# EAGLE design hk310_esc (EAGLE 9.6.1)
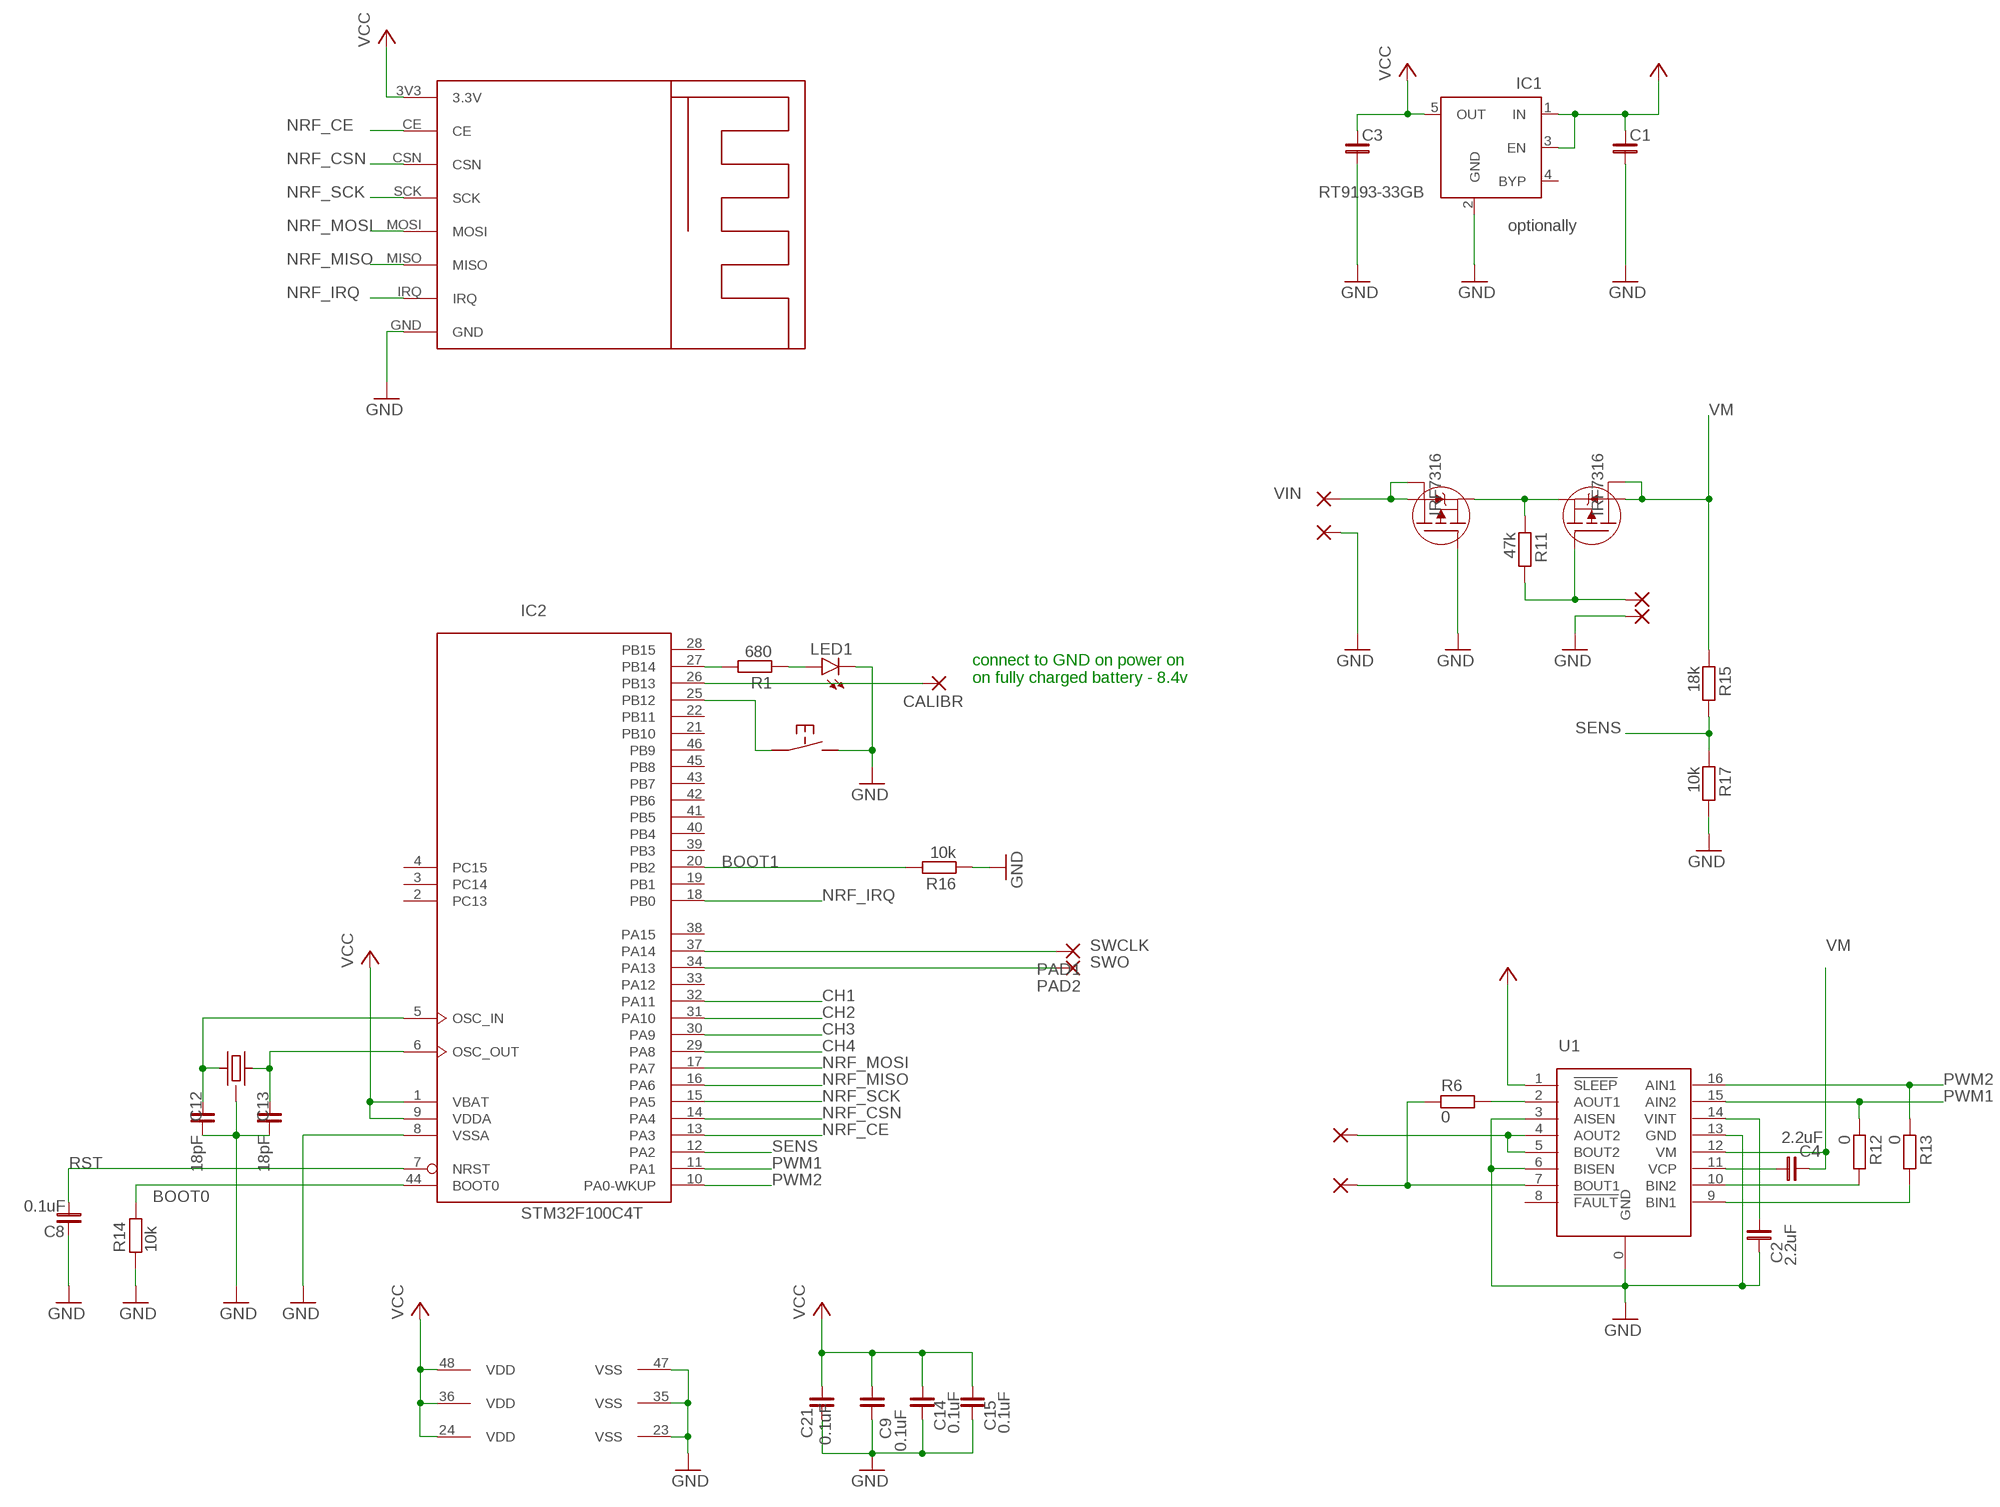
[diagram p0: schematic, sheet 1, part 1 of 2]
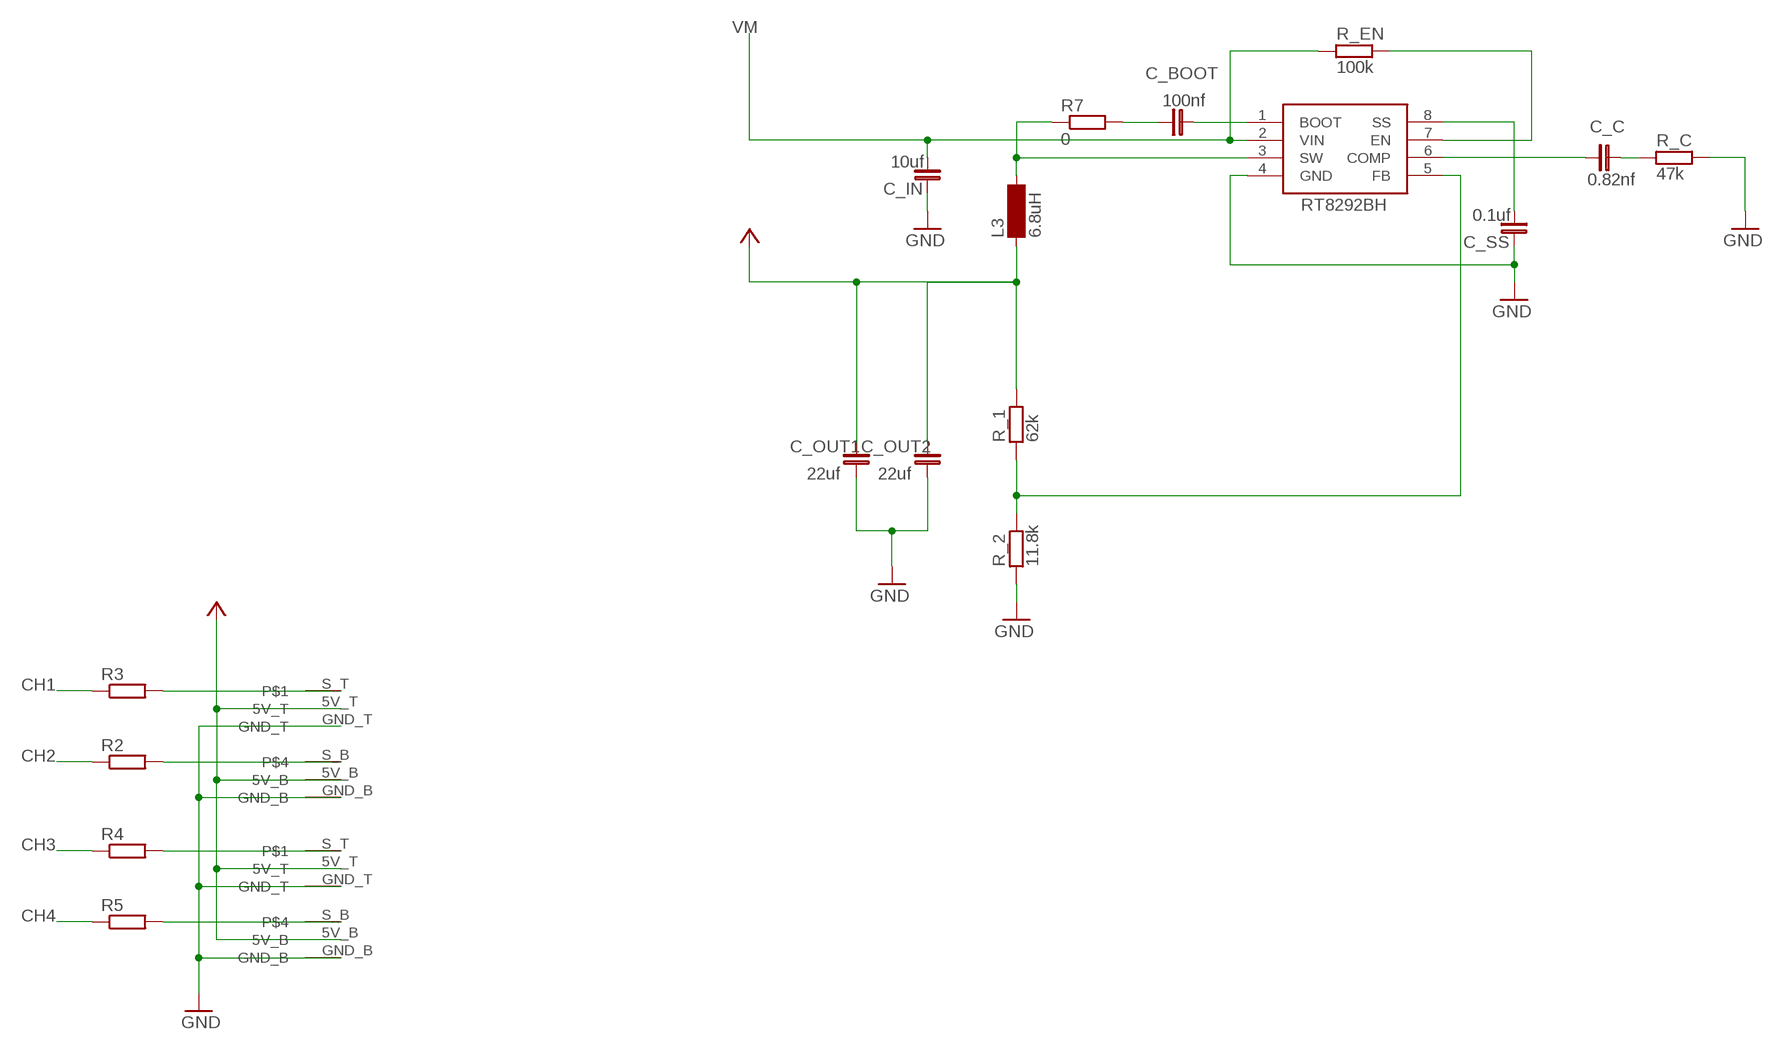
[diagram p1: schematic, sheet 1, part 2 of 2]

## Parts
C1  C_0805  [C0805]
C2  2.2uF  C_0805  [C0805]
C3  C_0805  [C0805]
C4  2.2uF  C_0805  [C0805]
C8  0.1uF  C_0603  [C0603]
C9  0.1uF  C_0603  [C0603]
C12  18pF  C_0603  [C0603]
C13  18pF  C_0603  [C0603]
C14  0.1uF  C_0603  [C0603]
C15  0.1uF  C_0603  [C0603]
C21  0.1uF  C_0603  [C0603]
C_BOOT  100nf  C_0402  [C0402]
C_C  0.82nf  C_0402  [C0402]
C_IN  10uf  C_1206  [C1206]
C_OUT1  22uf  C_0805  [C0805]
C_OUT2  22uf  C_0805  [C0805]
C_SS  0.1uf  C_0402  [C0402]
CALIBR  SMD2  [SMD1,27-2,54]
IC1  RT9193-33GB  MIC5219XX  [SOT23-5]
IC2  STM32F100C4T  [LQFP48]
L3  6.8uH  MS85  [MS85]
LED1  LED  [SMARTLED-TTW]
PAD1  SMD2  [SMD1,27-2,54]
PAD2  SMD2  [SMD1,27-2,54]
PAD3  WIREPADSMD5-1,8  [5-1,8]
PAD4  WIREPADSMD5-1,8  [5-1,8]
PAD5  WIREPADSMD5-1,8  [5-1,8]
PAD6  WIREPADSMD5-1,8  [5-1,8]
PAD7  WIREPADSMD5-1,8  [5-1,8]
PAD8  WIREPADSMD5-1,8  [5-1,8]
R1  680  R_0805  [R0805]
R2  R-EU_R1206  [R1206]
R3  R-EU_R1206  [R1206]
R4  R-EU_R1206  [R1206]
R5  R-EU_R1206  [R1206]
R6  0  R_1206  [R1206]
R7  0  R-EU_R1206  [R1206]
R11  47k  R_0805  [R0805]
R12  0  R_1206  [R1206]
R13  0  R_1206  [R1206]
R14  10k  R_0805  [R0805]
R15  18k  R_0805  [R0805]
R16  10k  R_0805  [R0805]
R17  10k  R_0805  [R0805]
R_1  62k  R_0402  [R0402]
R_2  11.8k  R_0402  [R0402]
R_C  47k  R_0402  [R0402]
R_EN  100k  R_0402  [R0402]
RT8292BH  RT8292B  [SO8-2]
U1  DRV8833  [PWP16]
U$1  NRF24MINI  [NRF24MINI]
U$2  PINHEAD_SMD  [PINHEAD_SMD]
U$3  PINHEAD_SMD  [PINHEAD_SMD]
U$5  IRF7104  [SO8-2]
U$6  8Mhz  CRYSTAL_3PINS  [CRYSTAL_3PINS]
U$7  SMALL_BUTTON  [SMALL_BUTTON]

## Nets
+5V: C1.1 C_OUT1.2 C_OUT2.2 IC1.1(IN) IC1.3(EN) L3.1 R_1.2 U1.1(!SLEEP) U$2.5V_B U$2.5V_T U$3.5V_B U$3.5V_T
BOOT0: IC2.44(BOOT0) R14.2
BOOT1: IC2.20(PB2) R16.2
CH1: IC2.32(PA11) R3.1
CH2: IC2.31(PA10) R2.1
CH3: IC2.30(PA9) R4.1
CH4: IC2.29(PA8) R5.1
GND: C1.2 C2.1 C3.2 C8.1 C9.1 C12.1 C13.1 C14.1 C15.1 C21.1 C_IN.1 C_OUT1.1 C_OUT2.1 C_SS.1 IC1.2(GND) IC2.8(VSSA) IC2.23(VSS) IC2.35(VSS) IC2.47(VSS) LED1.C@1(C) PAD5.1(P) PAD8.1(P) R14.1 R16.1 R17.2 R_2.1 R_C.2 RT8292BH.4(GND) U1.0(GND) U1.3(AISEN) U1.6(BISEN) U1.13(GND) U$1.GND U$2.GND_B U$2.GND_T U$3.GND_B U$3.GND_T U$5.4(G) U$6.GND U$7.2_1 U$7.2_2
N$1: IC2.25(PB12) U$7.1_1 U$7.1_2
N$3: IC2.27(PB14) R1.2
N$5: LED1.A@1(A) R1.1
N$6: PAD3.1(P) U1.4(AOUT2) U1.5(BOUT2)
N$9: R6.2 U1.2(AOUT1)
N$10: C2.2 U1.14(VINT)
N$11: C4.2 U1.11(VCP)
N$12: CALIBR.1(P) IC2.26(PB13)
N$14: C12.2 IC2.5(OSC_IN) U$6.P$1
N$15: R12.2 U1.10(BIN2)
N$17: R3.2 U$2.S_T
N$18: R2.2 U$2.S_B
N$19: R4.2 U$3.S_T
N$20: R5.2 U$3.S_B
N$21: PAD7.1(P) R6.1 U1.7(BOUT1)
N$22: C_BOOT.1 R7.2
N$27: C13.2 IC2.6(OSC_OUT) U$6.P$2
N$28: PAD6.1(P) R11.2 U$5.2(G)
N$29: R13.2 U1.9(BIN1)
N$30: R_EN.2 RT8292BH.7(EN)
N$33: C_SS.2 RT8292BH.8(SS)
N$34: C_BOOT.2 RT8292BH.1(BOOT)
N$35: L3.2 R7.1 RT8292BH.3(SW)
N$36: R_1.1 R_2.2 RT8292BH.5(FB)
N$38: C_C.2 R_C.1
N$39: C_C.1 RT8292BH.6(COMP)
NRF_CE: IC2.13(PA3) U$1.CE
NRF_CSN: IC2.14(PA4) U$1.CSN
NRF_IRQ: IC2.18(PB0) U$1.IRQ
NRF_MISO: IC2.16(PA6) U$1.MISO
NRF_MOSI: IC2.17(PA7) U$1.MOSI
NRF_SCK: IC2.15(PA5) U$1.SCK
PWM1: IC2.11(PA1) R12.1 U1.15(AIN2)
PWM2: IC2.10(PA0-WKUP) R13.1 U1.16(AIN1)
RST: C8.2 IC2.7(NRST)
SENS: IC2.12(PA2) R15.2 R17.1
SWCLK: IC2.37(PA14) PAD1.1(P)
SWO: IC2.34(PA13) PAD2.1(P)
VCC: C3.1 C9.2 C14.2 C15.2 C21.2 IC1.5(OUT) IC2.1(VBAT) IC2.9(VDDA) IC2.24(VDD) IC2.36(VDD) IC2.48(VDD) U$1.3V3(3.3V)
VIN: PAD4.1(P) U$5.5(D) U$5.6(D)
VIN_PROT: R11.1 U$5.1(S) U$5.3(S)
VM: C4.1 C_IN.2 R15.1 R_EN.1 RT8292BH.2(VIN) U1.12(VM) U$5.7(D) U$5.8(D)
Unconnected: IC1.4(BYP) IC2.2(PC13) IC2.3(PC14) IC2.4(PC15) IC2.19(PB1) IC2.21(PB10) IC2.22(PB11) IC2.28(PB15) IC2.33(PA12) IC2.38(PA15) IC2.39(PB3) IC2.40(PB4) IC2.41(PB5) IC2.42(PB6) IC2.43(PB7) IC2.45(PB8) IC2.46(PB9) U1.8(!FAULT)

## Notes on the sheet
- optionally
- connect to GND on power on
  on fully charged battery - 8.4v

## Library data of the parts
C1-C4 C8 C9 C12-C15 C21 C_BOOT C_C C_IN C_OUT1 C_OUT2 C_SS = skydrop:C_: NON-POLARIZED CAP
CALIBR PAD1 PAD2 = wirepad:SMD2: SMD PAD
IC1 = skydrop:MIC5219XX: VOLTAGE REGULATOR; OC_FARNELL: unknown; OC_NEWARK: unknown
IC2 = micro-stm_v3:STM32F100C*T: ARM 32-bit Cortex™-M3 CPU 24 MHz maximum frequency 16 to 128 Kbytes of Flash memory 4 to 8 kbytes of SRAM 37 GPIOs 2.0 to 3.6 V application supply
L3 = inductor-neosid:MS85: INDUCTOR SMD power inductor; OC_FARNELL: unknown; OC_NEWARK: unknown
LED1 = led:LED: LED OSRAM: - CHIPLED LG R971, LG N971, LY N971, LG Q971, LY Q971, LO R971, LY R971 LH N974, LH R974 LS Q976, LO Q976, LY Q976 LO Q996 - Hyper CHIPLED LW Q18S LB Q993, LB Q99A, LB R99A - SideLED LS A670, LO A670, LY A670, LG A670, LP A670 LB A673, LV A673, LT A673, LW A673 LH A674 LY A675 LS A676, LA A676, LO A676, LY A676, LW A676 LS A679, LY A679, LG A679 - Hyper Micro SIDELED® LS Y876, LA Y876, LO Y876, LY Y876 LT Y87S - SmartLED LW L88C, LW L88S LB L89C, LB L89S, LG L890 LS L89K, LO L89K, LY L89K LS L896, LA L896, LO L896, LY L896 - TOPLED LS T670, LO T670, LY T670, LG T670, LP T670 LSG T670, LSP T670, LSY T670, LOP T670, LYG T670 LG T671, LOG T671, LSG T671 LB T673, LV T673, LT T673, LW T673 LH T674 LS T676, LA T676, LO T676, LY T676, LB T676, LH T676, LSB T676, LW T676 LB T67C, LV T67C, LT T67C, LS T67K, LO T67K, LY T67K, LW E67C LS E67B, LA E67B, LO E67B, LY E67B, LB E67C, LV E67C, LT E67C LW T67C LS T679, LY T679, LG T679 LS T770, LO T770, LY T770, LG T770, LP T770 LB T773, LV T773, LT T773, LW T773 LH T774 LS E675, LA E675, LY E675, LS T675 LS T776, LA T776, LO T776, LY T776, LB T776 LHGB T686 LT T68C, LB T68C - Hyper Mini TOPLED® LB M676 - Mini TOPLED Santana® LG M470 LS M47K, LO M47K, LY M47K Source: http://www.osram.convergy.de LUXEON: - LUMILED® LXK2-PW12-R00, LXK2-PW12-S00, LXK2-PW14-U00, LXK2-PW14-V00 LXK2-PM12-R00, LXK2-PM12-S00, LXK2-PM14-U00 LXK2-PE12-Q00, LXK2-PE12-R00, LXK2-PE12-S00, LXK2-PE14-T00, LXK2-PE14-U00 LXK2-PB12-K00, LXK2-PB12-L00, LXK2-PB12-M00, LXK2-PB14-N00, LXK2-PB14-P00, LXK2-PB14-Q00 LXK2-PR12-L00, LXK2-PR12-M00, LXK2-PR14-Q00, LXK2-PR14-R00 LXK2-PD12-Q00, LXK2-PD12-R00, LXK2-PD12-S00 LXK2-PH12-R00, LXK2-PH12-S00 LXK2-PL12-P00, LXK2-PL12-Q00, LXK2-PL12-R00 Source: www.luxeon.com KINGBRIGHT: KA-3528ASYC Source: www.kingbright.com
PAD3-PAD8 = wirepad:WIREPAD: Wire PAD connect wire on PCB
R1 R6 R11-R17 R_1 R_2 R_C R_EN = skydrop:R_: RESISTOR
R2-R5 R7 = skydrop:R-EU_: RESISTOR, European symbol
RT8292BH = skydrop:RT8292B; RT8292BH: RT8292BH
U1 = skydrop:DRV8833
U$1 = nrf24mini:NRF24MINI
U$2 U$3 = skydrop:PINHEAD_SMD
U$5 = irf-2:IRF7104: HEXFET® Power MOSFET Adavanced Process Technology Ultra Low On-Resistance Dual P-Channel MOSFET Surface Mount Available in Tape & Reel Dynamic dv/dt Rating Fast Switching Please connect both Drain-Pins of each FET for thermal Reasons! (Pin 5 with Pin 6, 7 with 8); IRF7316: IRF7316
U$6 = skydrop:CRYSTAL_3PINS
U$7 = skydrop:SMALL_BUTTON

## Net classes
1 vcc: width 0.3 mm

## Board
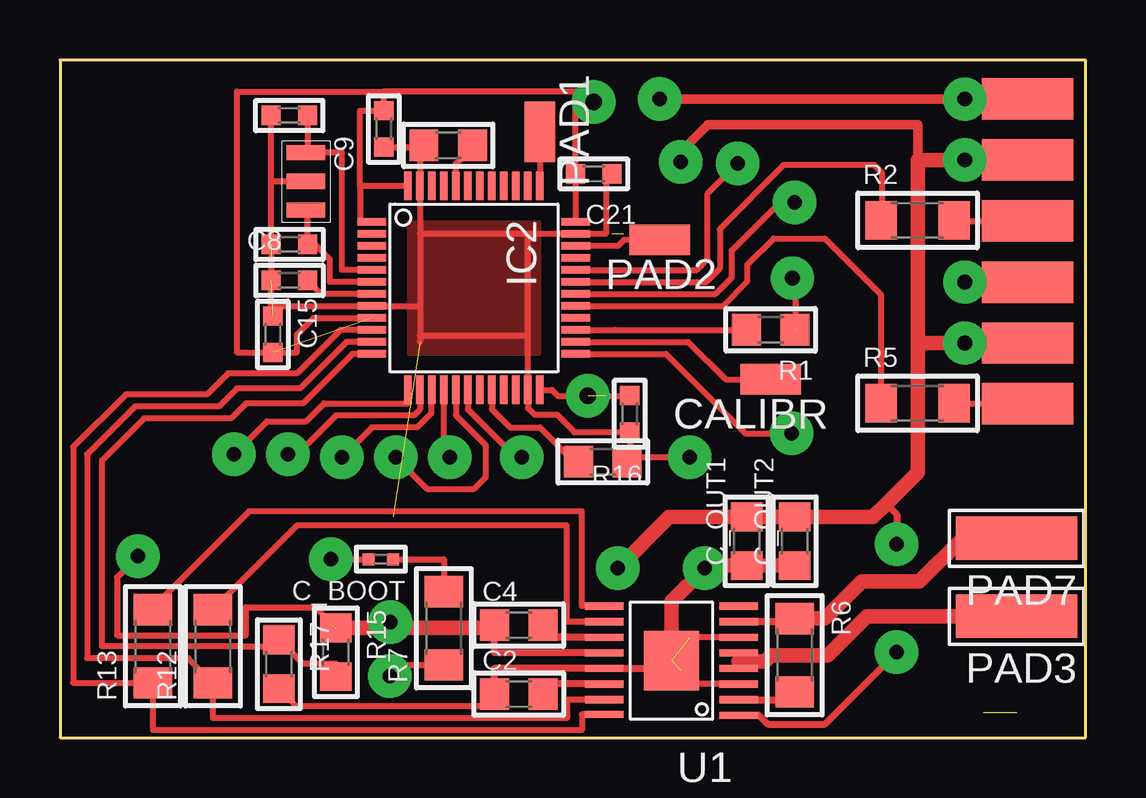
[diagram p2: board, top side]
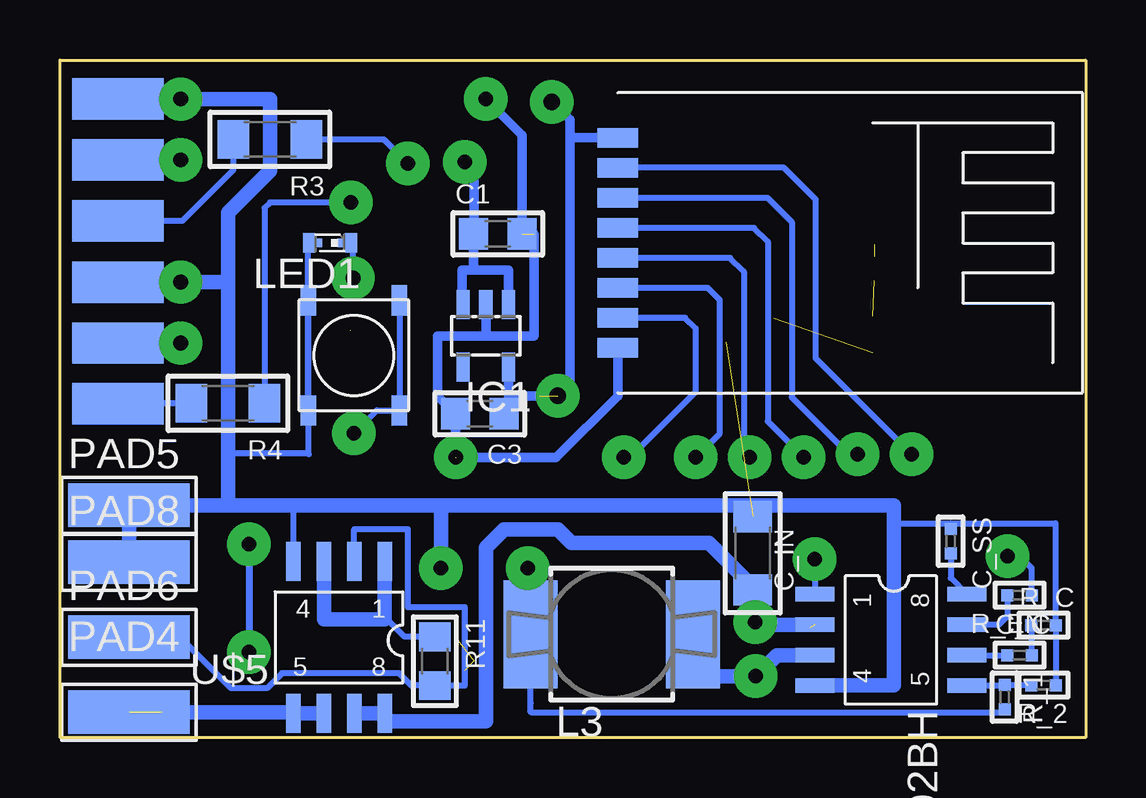
[diagram p3: board, bottom side, seen from below]

Size 42.75 x 28.25 mm. Coordinates in mm from the lower left corner, seen from the top.
Outline: 0,0 42.75,0 42.75,28.25 0,28.25 0,0
Copper layers (1*16): Top 0.035mm / dielectric 1.5mm / Bottom 0.035mm
Design rules "default *": minimum track width 10mil, minimum drill 24mil, track to track 0.2mm, track to pad 0.2mm, pad to pad 0.2mm, via to via 8mil, smd to smd 0.01mm, copper to edge 0mil, drill to drill 0.7mm, minimum pad ring 10mil, minimum via ring 8mil, stop-mask expansion 4mil, vias tented up to drill 0mil, thermal gap 10mil

### Footprints (pad centres in the part's own frame; a part is rotated, then mirrored left to right if it is on the bottom)
C0805 = smd 1.2 x 1.3: 1 -1.016,0; 2 1.016,0
C0603 = smd 0.8 x 0.8: 1 -0.762,0; 2 0.762,0
C0402 = smd 0.5 x 0.5: 1 -0.508,0; 2 0.508,0
C1206 = smd 1.3 x 1.6: 1 -1.524,0; 2 1.524,0
SMD1,27-2,54 = smd 1.27 x 2.54: 1 0,0
SOT23-5 = smd 0.55 x 1.2: 1 -0.95,-1.3; 2 0,-1.3; 3 0.95,-1.3; 4 0.95,1.3; 5 -0.95,1.3
LQFP48 = smd 0.3 x 1.2: 1 -2.75,-4.25; 2 -2.25,-4.25; 3 -1.75,-4.25; 4 -1.25,-4.25; 5 -0.75,-4.25; 6 -0.25,-4.25; 7 0.25,-4.25; 8 0.75,-4.25; 9 1.25,-4.25; 10 1.75,-4.25; 11 2.25,-4.25; 12 2.75,-4.25; 25 2.75,4.25; 26 2.25,4.25; 27 1.75,4.25; 28 1.25,4.25; 29 0.75,4.25; 30 0.25,4.25; 31 -0.25,4.25; 32 -0.75,4.25; 33 -1.25,4.25; 34 -1.75,4.25; 35 -2.25,4.25; 36 -2.75,4.25 | smd 1.2 x 0.3: 13 4.25,-2.75; 14 4.25,-2.25; 15 4.25,-1.75; 16 4.25,-1.25; 17 4.25,-0.75; 18 4.25,-0.25; 19 4.25,0.25; 20 4.25,0.75; 21 4.25,1.25; 22 4.25,1.75; 23 4.25,2.25; 24 4.25,2.75; 37 -4.25,2.75; 38 -4.25,2.25; 39 -4.25,1.75; 40 -4.25,1.25; 41 -4.25,0.75; 42 -4.25,0.25; 43 -4.25,-0.25; 44 -4.25,-0.75; 45 -4.25,-1.25; 46 -4.25,-1.75; 47 -4.25,-2.25; 48 -4.25,-2.75
MS85 = smd 4.5 x 2.25: 1 0,-3.383; 2 0,3.383
SMARTLED-TTW = smd 0.8 x 0.5: A 0,-0.875; C 0,0.875 | smd 0.35 x 0.35: A@1 0,-0.5; C@1 0,0.5
5-1,8 = smd 1.829 x 5.08: 1 0,0
R0805 = smd 1.2 x 1.3: 1 -1.016,0; 2 1.016,0
R1206 = smd 1.3 x 1.6: 1 -1.524,0; 2 1.524,0
R0402 = smd 0.5 x 0.5: 1 -0.508,0; 2 0.508,0
SO8-2 = smd 0.61 x 1.626: 1 -2.54,-2.54; 2 -1.27,-2.54; 3 0,-2.54; 4 1.27,-2.54; 5 1.27,3.81; 6 0,3.81; 7 -1.27,3.81; 8 -2.54,3.81
PWP16 = smd 2.46 x 2.31: 0 0,0 | smd 0.3 x 1.6: 1 -2.275,-2.8; 2 -1.625,-2.8; 3 -0.975,-2.8; 4 -0.325,-2.8; 5 0.325,-2.8; 6 0.975,-2.8; 7 1.625,-2.8; 8 2.275,-2.8; 9 2.275,2.8; 10 1.625,2.8; 11 0.975,2.8; 12 0.325,2.8; 13 -0.325,2.8; 14 -0.975,2.8; 15 -1.625,2.8; 16 -2.245,2.8
NRF24MINI = smd 1.676 x 0.813: 3V3 0,8.75; CE 0,7.5; CSN 0,6.25; GND 0,0; IRQ 0,1.25; MISO 0,2.5; MOSI 0,3.75; SCK 0,5
PINHEAD_SMD = smd 3.81 x 1.727 bottom: 5V_B 0,-1.27; GND_B 0,-3.81; S_B 0,1.27 | smd 3.81 x 1.727: 5V_T 0,-1.27; GND_T 0,-3.81; S_T 0,1.27
CRYSTAL_3PINS = smd 1.6 x 0.635: GND 0,0; P$1 0,1.2; P$2 0,-1.2
SMALL_BUTTON = smd 1.27 x 0.635: 1_1 -2.3,1.9; 1_2 2.3,1.9; 2_1 -2.3,-1.9; 2_2 2.3,-1.9

### Placement (x,y rotation side)
C1  24.5,21 0 bottom
C2  19.12,1.81 0 top
C3  25.25,13.5 180 bottom
C4  19.12,4.69 0 top
C8  9.56,19.06 0 top
C9  13.5,25.37 90 top
C12  9.56,25.94 0 top
C13  9.56,20.56 0 top
C14  23.75,13.5 90 top
C15  8.88,16.81 270 top
C21  22.25,23.5 180 top
C_BOOT  13.38,7.44 180 top
C_C  2.75,3.44 0 bottom
C_IN  13.88,7.69 270 bottom
C_OUT1  28.62,8.19 90 top
C_OUT2  30.62,8.19 90 top
C_SS  5.62,8.19 270 bottom
CALIBR  29.62,14.94 90 top
IC1  25,16.75 180 bottom
IC2  17.25,18.75 270 top
L3  19.75,4.31 270 bottom
LED1  31.5,20.62 90 bottom
PAD1  20,25.25 180 top
PAD2  25,20.75 90 top
PAD3  39.88,5.06 90 top
PAD4  39.88,1.06 270 bottom
PAD5  39.88,9.69 270 bottom
PAD6  39.88,4.19 270 bottom
PAD7  39.88,8.31 90 top
PAD8  39.88,7.31 270 bottom
R1  29.62,17 180 top
R2  35.75,21.56 0 top
R3  34,24.94 180 bottom
R4  35.75,13.94 180 bottom
R5  35.75,13.94 0 top
R6  30.62,3.44 270 top
R7  16,4.56 90 top
R11  27.12,3.19 270 bottom
R12  6.38,3.81 90 top
R13  3.88,3.81 90 top
R14  16.19,24.69 0 top
R15  11.5,3.56 270 top
R16  22.62,11.5 180 top
R17  9.12,3.06 270 top
R_1  3.38,1.69 270 bottom
R_2  1.75,2.19 180 bottom
R_C  1.75,4.69 0 bottom
R_EN  2.75,5.94 180 bottom
RT8292BH  8.75,3.44 270 bottom
U1  25.49,3.21 90 top
U$1  19.5,16.25 0 bottom
U$2  40.33,22.81 180 bottom
U$3  40.33,15.18 180 bottom
U$5  31.75,4.81 180 bottom
U$6  10.25,23.19 0 top
U$7  30.5,15.94 270 bottom

### Tracks (layer width: path | path; a pad name or v marks a point on that pad's centre or on a via)
+5V  (via drill 0.61 pad 1.8)
  Top 0.254: U$3.5V_B v37.72,16.45 | U$2.5V_B v37.72,24.08 | 25.95,24.08 v25.88,24 25.88,24.44
  Top 0.3: U1.1 29.13,0.93 29.5,0.56 31.88,0.56 v34.88,3.56 | 34.44,9.75 34.88,9.31 v34.88,8.06
  Top 0.4: 25.88,24.44 27,25.56 35.75,25.56 35.75,24.08
  Top 0.6: 35.75,16.45 v37.72,16.45 | 35.75,16.45 35.75,11.06 34.44,9.75 33.89,9.2 C_OUT2.2 C_OUT1.2 25.39,9.2 v23.25,7.06 | v37.72,24.08 35.75,24.08 35.75,16.45
  Bottom 0.254: 26,18.05 IC1.3 | 25.52,20.5 C1.1 25.5,21.02 | v37.72,16.45 U$3.5V_B | v37.72,24.08 U$2.5V_B | 23.13,1.44 L3.1 23.13,1.05 3.5,1.05 R_1.2
  Bottom 0.3: v34.88,8.06 v34.88,3.56
  Bottom 0.4: IC1.1 24.05,19.5 25.52,19.5 | 25.52,19.5 26,19.5 26,18.05 | C1.1 25.52,19.5 | v25.88,24 25.5,23.62 25.5,21.02
  Bottom 0.6: L3.1 23.25,4.43 v23.25,7.06
BOOT0
  Top 0.254: 16.5,23.48 IC2.44 16.5,23.94 17.2,24.64 R14.2 17.2,24.44
BOOT1
  Top 0.254: 18,14.3 IC2.20 18,13.69 18.75,12.94 20,12.94 21.44,11.5 R16.2
CH1  (via drill 0.61 pad 1.8)
  Top 0.254: IC2.32 26.55,19.5 26.99,19.94 26.99,22.68 v28.25,23.94
  Bottom 0.254: v28.25,23.94 29.25,24.94 R3.1
CH2
  Top 0.254: IC2.31 26.94,19 27.5,19.56 27.5,21.2 30.18,23.88 33.93,23.88 34.25,23.56 34.25,21.58 R2.1
CH3  (via drill 0.61 pad 1.8)
  Top 0.254: IC2.30 27.31,18.5 28,19.19 28,20.31 30,22.31 v30.62,22.31
  Bottom 0.254: v30.62,22.31 34,22.31 34.23,22.08 R4.1
CH4
  Top 0.254: IC2.29 27.62,18 28.66,19.03 28.66,19.72 29.75,20.81 31.88,20.81 34.23,18.46 R5.1
GND  (via drill 0.61 pad 1.8)  (7 unrouted)
  Top 0.254: 15,21 IC2.47 15,24.61 | 15,21 15,18 | 15,18 IC2.8 12.98,17.98 8.8,17.98 C8.1 8.8,20.06 | 19.5,21 IC2.35 22.75,21 22.75,23.23 22.89,23.38 22.89,23.37 C21.1 | 19.5,21 15,21 | 19.5,16.75 IC2.23 19.5,13.75 19.78,13.47 20.72,13.47 21.45,12.74 C14.1 23.75,11.69 | 19.5,16.75 19.5,21 | 15,18 15,16.75 | 19.5,16.75 15,16.75 | 15,16.75 15,16.5 | C9.1 14.34,24.61 14.35,24.61 15,24.61 | 15,24.61 15.08,24.69 R14.1 | 25.49,2.88 25.49,3.19 U1.0 | v37.72,18.99 U$3.GND_B | v37.72,26.62 U$2.GND_B | v25,26.62 | C2.1 17.61,1.31 9.86,1.31 R17.2 | 23.75,11.69 23.75,11.61 R16.1 | v26.25,11.69 23.75,11.69 | C13.1 8.8,23.19 | 8.8,23.19 C12.1 | U$6.GND 8.8,23.19 | U1.3 26.45,2.23 25.88,2.81 | U1.6 26.25,4.18
  Top 0.3: U1.3 28.27,2.21 | 25.49,2.88 U1.13 18.11,2.88 C2.1
  Top 0.4: v25,26.62 v37.72,26.62
  Top 0.6: 25.49,3.19 25.49,5.68 v26.88,7.06 26.98,7.17 C_OUT1.1 C_OUT2.1
  Bottom 0.254: C3.2 26.27,11.73 | U$3.GND_B v37.72,18.99 | U$2.GND_B v37.72,26.62 | U$7.2_1 U$7.2_2 | U$7.2_2 32.4,11.84 | 32.38,11.81 32.4,11.84 | LED1.C@1 32.4,20.62 U$7.2_2 | R_2.1 R_C.2 1.24,8.94 5.62,8.94 | 11.29,2.19 RT8292BH.4 | 8,8.94 5.62,8.94 | C_SS.1 5.62,8.94 | 32.4,11.84 35.75,11.84 35.75,11.81 | 33,9.69 33.02,9.67 U$5.4
  Bottom 0.4: IC1.2 25,16.75 | 25,16.75 27.02,16.75 27.02,14.25 C3.2 26.27,11.69 v26.25,11.68 | 25,16.75 23,16.75 23,21 | U$1.GND 19.5,14.25 22.06,11.69 v26.25,11.69 | C1.2 23.48,25.11 v25,26.62
  Bottom 0.6: v37.72,26.62 34,26.62 34,23.64 35.75,21.89 35.75,18.99 | 35.75,18.99 v37.72,18.99 | 35.75,18.99 35.75,12.31 35.75,11.81 35.75,9.69 | 11.29,2.19 8,2.19 8,8.94 8,9.69 26.88,9.69 | 35.75,9.69 33,9.69 26.88,9.69 | PAD8.1 PAD5.1 35.75,9.69 | v26.88,7.06 26.88,9.69
  pour Top: 14.5,21.5 14.5,16 20,16 20,21.5
N$1  (via drill 0.61 pad 1.8)
  Top 0.254: IC2.25 25.25,16 28.56,12.69 v30.5,12.69
  Bottom 0.254: U$7.1_1 U$7.1_2 29.55,13.64 v30.5,12.69
N$3
  Top 0.254: IC2.27 23.13,17 | 23.13,17 | 23.13,17 R1.2
N$5  (via drill 0.61 pad 1.8)  (1 unrouted)
  Top 0.254: 30.66,17 30.66,19.03 v30.53,19.16
  Bottom 0.254: v30.53,19.16 30.53,20.62 LED1.A@1
N$6
  Top 0.254: 28.87,3.53 U1.5 28.29,3.19 U1.4 28.87,2.88 | 39.88,5.03 PAD3.1
  Top 0.6: 28.29,3.19 29.38,3.19 29.62,3.44 32,3.44 33.62,5.06 PAD3.1
N$9
  Top 0.3: U1.2 30.62,1.58 R6.2
N$10
  Top 0.3: U1.14 20.56,2.23 C2.2
N$11
  Top 0.3: U1.11 20.64,4.18 C4.2
N$12
  Top 0.254: IC2.26 26.19,16.5 27.75,14.94 CALIBR.1
N$14
  Top 0.254: C12.2 10.32,24.46 U$6.P$1 11.75,24.39 11.75,19.5 IC2.5
N$15
  Top 0.254: U1.10 21.12,4.83 21.12,8.83 9.88,8.83 R12.2
N$17
  Bottom 0.254: R3.2 35.52,23.66 37.65,21.54 U$2.S_T
N$18
  Top 0.254: R2.2 37.3,21.54 U$2.S_B
N$19
  Bottom 0.254: R4.2 40.3,13.94 U$3.S_T
N$20
  Top 0.254: R5.2 40.3,13.94 U$3.S_B
N$21
  Top 0.3: R6.1 30.5,4.83 U1.7
  Top 0.6: R6.1 31.88,4.96 33.42,6.51 35.83,6.51 37.62,8.31 PAD7.1
N$22
  Top 0.254: C_BOOT.1 16,7.44 R7.2
N$27
  Top 0.254: U$6.P$2 10.33,21.91 C13.2 10.62,20.56 11.25,19.94 11.25,19 IC2.6
N$28
  Bottom 0.254: U$5.2 30.48,8.69 28.25,8.69 28.25,5.44 25.88,5.44 25.88,2.17 R11.2 28.11,2.17 28.62,2.69 33.5,2.69 34.12,2.06 35.62,2.06 37.75,4.19 PAD6.1
N$29
  Top 0.254: U1.9 21.75,5.48 21.75,9.44 7.88,9.44 3.88,5.44 R13.2
N$30
  Bottom 0.254: R_EN.2 3.26,5.06 3.61,4.71 RT8292BH.7
N$33
  Bottom 0.254: C_SS.2 5.62,6.65 RT8292BH.8
N$34  (via drill 0.61 pad 1.8)
  Top 0.254: v11.29,7.44 C_BOOT.2
  Bottom 0.254: v11.29,7.44 RT8292BH.1
N$35  (via drill 0.61 pad 1.8)
  Top 0.254: v13.75,2.56 14.23,3.04 R7.1
  Bottom 0.254: L3.2 16.37,2.56
  Bottom 0.6: 16.37,2.56 v13.75,2.56 12.88,3.44 RT8292BH.3
N$36
  Bottom 0.254: R_2.2 3.37,2.19 R_1.1 3.38,2.17 RT8292BH.5
N$38
  Bottom 0.254: R_C.1 2.26,3.45 C_C.2
N$39
  Bottom 0.254: RT8292BH.6 C_C.1
NRF_CE  (via drill 0.61 pad 1.8)
  Top 0.254: IC2.13 14.5,13.94 11,13.94 10.25,13.19 8.62,13.19 v7.25,11.81
  Bottom 0.254: v7.25,11.81 11.25,15.81 11.25,22.44 12.56,23.75 U$1.CE
NRF_CSN  (via drill 0.61 pad 1.8)
  Top 0.254: IC2.14 15,13.69 14.75,13.44 11.5,13.44 9.88,11.81 v9.5,11.81
  Bottom 0.254: U$1.CSN 13.25,22.5 12.25,21.5 12.25,14.19 9.88,11.81 v9.5,11.81
NRF_IRQ  (via drill 0.61 pad 1.8)
  Top 0.254: IC2.18 17,13.69 19,11.69 v19.25,11.69
  Bottom 0.254: v19.25,11.69 19,11.69 16.25,14.44 16.25,17.06 16.69,17.5 U$1.IRQ
NRF_MISO  (via drill 0.61 pad 1.8)
  Top 0.254: v16.25,11.69 16,11.94 IC2.16
  Bottom 0.254: v16.25,11.69 15.25,12.69 15.25,18.25 15.75,18.75 U$1.MISO
NRF_MOSI  (via drill 0.61 pad 1.8)
  Top 0.254: 14.23,11.71 v14,11.69 15.31,10.37 17.25,10.37 17.75,10.87 17.75,12.19 16.5,13.44 IC2.17 16.52,14.48
  Bottom 0.254: v14,11.69 14.25,11.94 14.25,19.44 14.81,20 U$1.MOSI
NRF_SCK  (via drill 0.61 pad 1.8)
  Top 0.254: v11.75,11.69 13,12.94 14.89,12.94 15.48,13.52 15.48,14.48 IC2.15
  Bottom 0.254: v11.75,11.69 13.25,13.19 13.25,20.69 13.81,21.25 U$1.SCK
PWM1
  Top 0.254: U1.15 21.12,1.58 21.12,0.81 6.38,0.81 R12.1 5.35,3.31 1.12,3.31 1.12,11.81 3.12,13.81 6.62,13.81 7.38,14.56 10,14.56 11.94,16.5 IC2.11
PWM2
  Top 0.254: R13.1 3.88,0.31 21.75,0.31 21.75,0.96 U1.16 | R13.1 3.88,2.31 | IC2.10 11.69,17 9.88,15.19 7,15.19 6.12,14.31 2.75,14.31 0.55,12.11 0.55,2.29 R13.1
RST
  Top 0.254: 12.98,18.48 IC2.7 10.89,18.5 C8.2
SENS
  Top 0.254: IC2.12 12.19,16 10.12,13.94 7.75,13.94 7.12,13.31 3.5,13.31 1.75,11.56 1.75,3.81 6.62,3.81 7.62,3.81 9.12,3.81 9.26,3.94 | 9.26,3.94 R17.1 9.25,4.08 | 9.26,3.94 10.12,3.08 11.5,3.08 R15.2
SWCLK
  Top 0.254: 19.98,23.02 IC2.37 PAD1.1 20,24.71
SWO
  Top 0.254: 21.52,20.52 IC2.34 23.25,20.5 23.5,20.75 PAD2.1
VCC  (via drill 0.7 pad 1.8)  (2 unrouted)
  Top 0.254: 21.5,23.23 C21.2 | IC2.24 20.5,14.5 20.75,14.25 22.77,14.25 | 12.5,23 IC2.48 | 13.5,26.94 C9.2 12.5,26.13 12.5,23 | IC2.36 C21.2 | C21.2 21.49,26.44 | 21.49,26.44 21.49,26.94 13.5,26.94 | IC2.1 12.5,21.5 12.5,23 | v22,14.25 23.74,14.25 C14.2 | v22.25,26.5 22.19,26.44 21.49,26.44 | IC2.9 10.56,17.5 9.88,16.81 9.88,16.06 7.38,16.06 7.38,26.94 13.5,26.94
  Bottom 0.254: 23.8,13.5 C3.1 | 24.05,14.25 24.05,13.75
  Bottom 0.4: v22.25,26.5 21.5,25.75 21.5,25 | 21.5,25 21.5,14.75 v22,14.25 24.05,14.25 | IC1.5 24.05,13.75 24.05,13.5 C3.1 | U$1.3V3 21.5,25
VIN  (1 unrouted)
  Bottom 0.254: 33.08,1.06 U$5.5
  Bottom 0.6: U$5.6 U$5.5 | 38.48,1.06 33.08,1.06
VIN_PROT
  Bottom 0.254: 29.21,4.94 29.12,4.94 28.39,4.2 R11.1
  Bottom 0.6: U$5.3 31.75,4.94 29.21,4.94 U$5.1
VM  (via drill 0.61 pad 1.8)  (1 unrouted)
  Top 0.254: 17.97,4.55 C4.1 17.97,4.54 | v3.25,7.56 2.38,6.69 2.38,4.26 7.75,4.26 7.75,5.44 10.64,5.44 R15.1
  Top 0.3: 18,4.58 C4.1 18.11,3.53 U1.12
  Top 0.6: 18,4.58 R15.1
  Bottom 0.254: R_EN.1 2.24,7.06 2.74,7.56 v3.25,7.56 | 13.62,4.83 13.62,4.81 v13.77,4.81 | 13.89,6.3 C_IN.2 13.77,6.06 | 29.88,0.94 30.06,0.94 30.12,1
  Bottom 0.6: U$5.7 30.12,1 U$5.8 29.21,0.69 25,0.69 25,7.94 24.25,8.69 22,8.69 21.43,8.11 15.7,8.11 13.89,6.3 | RT8292BH.2 13.5,4.71 13.62,4.83 13.88,5.08 | v13.77,4.81 13.77,6.06